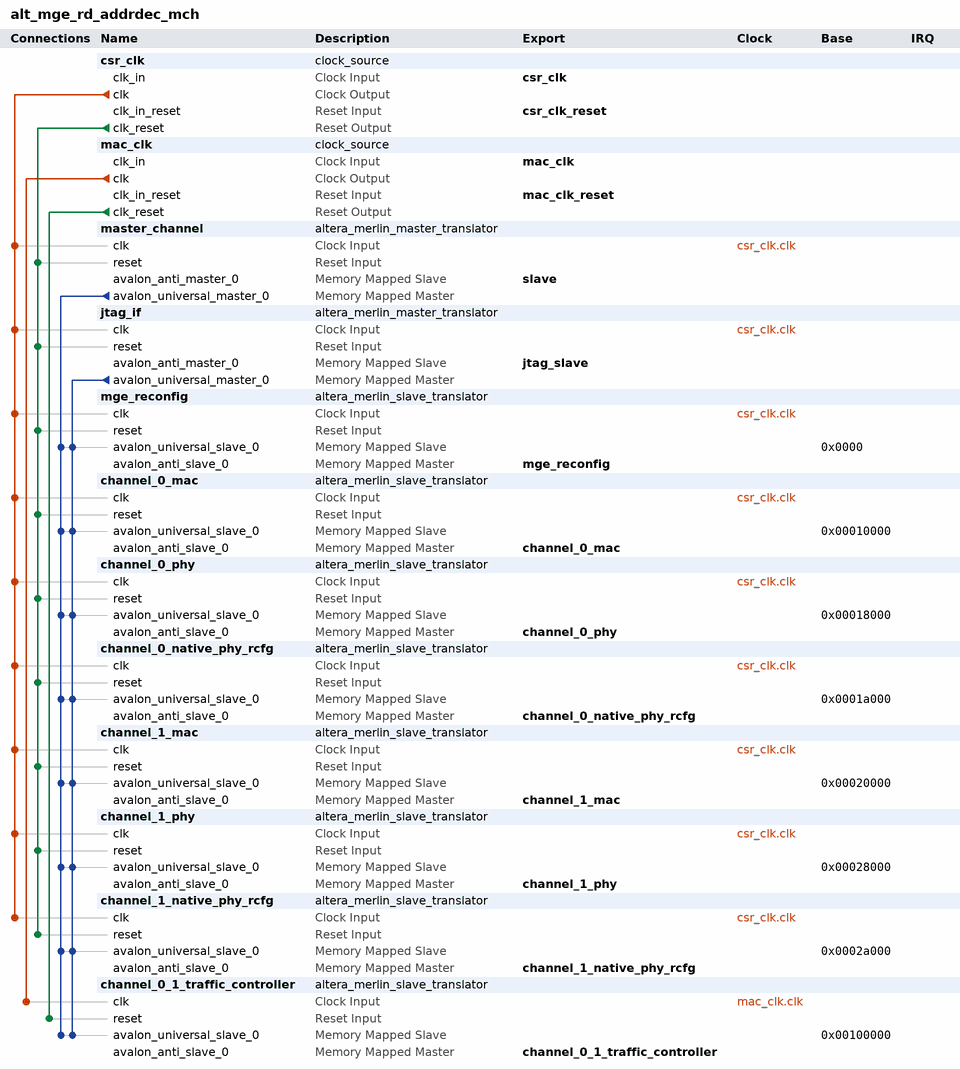
[diagram p0: system contents]
# Platform Designer (Qsys) system alt_mge_rd_addrdec_mch, Arria 10 10AX115S4F45I3SG
# Parameters at their usual value, and those the tool derives, are not listed.
package require -exact qsys 1.0
create_system alt_mge_rd_addrdec_mch
set_project_property DEVICE_FAMILY {Arria 10}
set_project_property DEVICE 10AX115S4F45I3SG

add_component csr_clk ip/alt_mge_rd_addrdec_mch/alt_mge_rd_addrdec_mch_csr_clk.ip clock_source csr_clk 0

add_component mac_clk ip/alt_mge_rd_addrdec_mch/alt_mge_rd_addrdec_mch_mac_clk.ip clock_source mac_clk 

add_component master_channel ip/alt_mge_rd_addrdec_mch/alt_mge_rd_addrdec_mch_master_channel.ip altera_merlin_master_translator master_channel 18.0

add_component jtag_if ip/alt_mge_rd_addrdec_mch/alt_mge_rd_addrdec_mch_jtag_if.ip altera_merlin_master_translator jtag_if 18.0

add_component mge_reconfig ip/alt_mge_rd_addrdec_mch/alt_mge_rd_addrdec_mch_mge_reconfig.ip altera_merlin_slave_translator mge_reconfig 18.0

add_component channel_0_mac ip/alt_mge_rd_addrdec_mch/alt_mge_rd_addrdec_mch_channel_0_mac.ip altera_merlin_slave_translator channel_0_mac 18.0

add_component channel_0_phy ip/alt_mge_rd_addrdec_mch/alt_mge_rd_addrdec_mch_channel_0_phy.ip altera_merlin_slave_translator channel_0_phy 18.0

add_component channel_0_native_phy_rcfg ip/alt_mge_rd_addrdec_mch/alt_mge_rd_addrdec_mch_channel_0_native_phy_rcfg.ip altera_merlin_slave_translator channel_0_native_phy_rcfg 18.0

add_component channel_1_mac ip/alt_mge_rd_addrdec_mch/alt_mge_rd_addrdec_mch_channel_1_mac.ip altera_merlin_slave_translator channel_1_mac 18.0

add_component channel_1_phy ip/alt_mge_rd_addrdec_mch/alt_mge_rd_addrdec_mch_channel_1_phy.ip altera_merlin_slave_translator channel_1_phy 18.0

add_component channel_1_native_phy_rcfg ip/alt_mge_rd_addrdec_mch/alt_mge_rd_addrdec_mch_channel_1_native_phy_rcfg.ip altera_merlin_slave_translator channel_1_native_phy_rcfg 18.0

add_component channel_0_1_traffic_controller ip/alt_mge_rd_addrdec_mch/alt_mge_rd_addrdec_mch_channel_0_1_traffic_controller.ip altera_merlin_slave_translator channel_0_1_traffic_controller 18.0

# connections
add_connection csr_clk.clk channel_0_mac.clk clock
add_connection csr_clk.clk channel_0_native_phy_rcfg.clk clock
add_connection csr_clk.clk channel_0_phy.clk clock
add_connection csr_clk.clk channel_1_mac.clk clock
add_connection csr_clk.clk channel_1_native_phy_rcfg.clk clock
add_connection csr_clk.clk channel_1_phy.clk clock
add_connection csr_clk.clk jtag_if.clk clock
add_connection csr_clk.clk master_channel.clk clock
add_connection csr_clk.clk mge_reconfig.clk clock
add_connection mac_clk.clk channel_0_1_traffic_controller.clk clock
add_connection csr_clk.clk_reset channel_0_mac.reset reset
add_connection csr_clk.clk_reset channel_0_native_phy_rcfg.reset reset
add_connection csr_clk.clk_reset channel_0_phy.reset reset
add_connection csr_clk.clk_reset channel_1_mac.reset reset
add_connection csr_clk.clk_reset channel_1_native_phy_rcfg.reset reset
add_connection csr_clk.clk_reset channel_1_phy.reset reset
add_connection csr_clk.clk_reset jtag_if.reset reset
add_connection csr_clk.clk_reset master_channel.reset reset
add_connection csr_clk.clk_reset mge_reconfig.reset reset
add_connection mac_clk.clk_reset channel_0_1_traffic_controller.reset reset
add_connection jtag_if.avalon_universal_master_0 channel_0_1_traffic_controller.avalon_universal_slave_0 avalon
set_connection_parameter_value jtag_if.avalon_universal_master_0/channel_0_1_traffic_controller.avalon_universal_slave_0 baseAddress 0x00100000
add_connection jtag_if.avalon_universal_master_0 channel_0_mac.avalon_universal_slave_0 avalon
set_connection_parameter_value jtag_if.avalon_universal_master_0/channel_0_mac.avalon_universal_slave_0 baseAddress 0x00010000
add_connection jtag_if.avalon_universal_master_0 channel_0_native_phy_rcfg.avalon_universal_slave_0 avalon
set_connection_parameter_value jtag_if.avalon_universal_master_0/channel_0_native_phy_rcfg.avalon_universal_slave_0 baseAddress 0x0001a000
add_connection jtag_if.avalon_universal_master_0 channel_0_phy.avalon_universal_slave_0 avalon
set_connection_parameter_value jtag_if.avalon_universal_master_0/channel_0_phy.avalon_universal_slave_0 baseAddress 0x00018000
add_connection jtag_if.avalon_universal_master_0 channel_1_mac.avalon_universal_slave_0 avalon
set_connection_parameter_value jtag_if.avalon_universal_master_0/channel_1_mac.avalon_universal_slave_0 baseAddress 0x00020000
add_connection jtag_if.avalon_universal_master_0 channel_1_native_phy_rcfg.avalon_universal_slave_0 avalon
set_connection_parameter_value jtag_if.avalon_universal_master_0/channel_1_native_phy_rcfg.avalon_universal_slave_0 baseAddress 0x0002a000
add_connection jtag_if.avalon_universal_master_0 channel_1_phy.avalon_universal_slave_0 avalon
set_connection_parameter_value jtag_if.avalon_universal_master_0/channel_1_phy.avalon_universal_slave_0 baseAddress 0x00028000
add_connection jtag_if.avalon_universal_master_0 mge_reconfig.avalon_universal_slave_0 avalon
set_connection_parameter_value jtag_if.avalon_universal_master_0/mge_reconfig.avalon_universal_slave_0 baseAddress 0x0000
add_connection master_channel.avalon_universal_master_0 channel_0_1_traffic_controller.avalon_universal_slave_0 avalon
set_connection_parameter_value master_channel.avalon_universal_master_0/channel_0_1_traffic_controller.avalon_universal_slave_0 baseAddress 0x00100000
add_connection master_channel.avalon_universal_master_0 channel_0_mac.avalon_universal_slave_0 avalon
set_connection_parameter_value master_channel.avalon_universal_master_0/channel_0_mac.avalon_universal_slave_0 baseAddress 0x00010000
add_connection master_channel.avalon_universal_master_0 channel_0_native_phy_rcfg.avalon_universal_slave_0 avalon
set_connection_parameter_value master_channel.avalon_universal_master_0/channel_0_native_phy_rcfg.avalon_universal_slave_0 baseAddress 0x0001a000
add_connection master_channel.avalon_universal_master_0 channel_0_phy.avalon_universal_slave_0 avalon
set_connection_parameter_value master_channel.avalon_universal_master_0/channel_0_phy.avalon_universal_slave_0 baseAddress 0x00018000
add_connection master_channel.avalon_universal_master_0 channel_1_mac.avalon_universal_slave_0 avalon
set_connection_parameter_value master_channel.avalon_universal_master_0/channel_1_mac.avalon_universal_slave_0 baseAddress 0x00020000
add_connection master_channel.avalon_universal_master_0 channel_1_native_phy_rcfg.avalon_universal_slave_0 avalon
set_connection_parameter_value master_channel.avalon_universal_master_0/channel_1_native_phy_rcfg.avalon_universal_slave_0 baseAddress 0x0002a000
add_connection master_channel.avalon_universal_master_0 channel_1_phy.avalon_universal_slave_0 avalon
set_connection_parameter_value master_channel.avalon_universal_master_0/channel_1_phy.avalon_universal_slave_0 baseAddress 0x00028000
add_connection master_channel.avalon_universal_master_0 mge_reconfig.avalon_universal_slave_0 avalon
set_connection_parameter_value master_channel.avalon_universal_master_0/mge_reconfig.avalon_universal_slave_0 baseAddress 0x0000

# exported interfaces
add_interface channel_0_1_traffic_controller avalon master
set_interface_property channel_0_1_traffic_controller EXPORT_OF channel_0_1_traffic_controller.avalon_anti_slave_0
add_interface channel_0_mac avalon master
set_interface_property channel_0_mac EXPORT_OF channel_0_mac.avalon_anti_slave_0
add_interface channel_0_native_phy_rcfg avalon master
set_interface_property channel_0_native_phy_rcfg EXPORT_OF channel_0_native_phy_rcfg.avalon_anti_slave_0
add_interface channel_0_phy avalon master
set_interface_property channel_0_phy EXPORT_OF channel_0_phy.avalon_anti_slave_0
add_interface channel_1_mac avalon master
set_interface_property channel_1_mac EXPORT_OF channel_1_mac.avalon_anti_slave_0
add_interface channel_1_native_phy_rcfg avalon master
set_interface_property channel_1_native_phy_rcfg EXPORT_OF channel_1_native_phy_rcfg.avalon_anti_slave_0
add_interface channel_1_phy avalon master
set_interface_property channel_1_phy EXPORT_OF channel_1_phy.avalon_anti_slave_0
add_interface csr_clk clock sink
set_interface_property csr_clk EXPORT_OF csr_clk.clk_in
add_interface csr_clk_reset reset sink
set_interface_property csr_clk_reset EXPORT_OF csr_clk.clk_in_reset
add_interface jtag_slave avalon slave
set_interface_property jtag_slave EXPORT_OF jtag_if.avalon_anti_master_0
add_interface mac_clk clock sink
set_interface_property mac_clk EXPORT_OF mac_clk.clk_in
add_interface mac_clk_reset reset sink
set_interface_property mac_clk_reset EXPORT_OF mac_clk.clk_in_reset
add_interface mge_reconfig avalon master
set_interface_property mge_reconfig EXPORT_OF mge_reconfig.avalon_anti_slave_0
add_interface slave avalon slave
set_interface_property slave EXPORT_OF master_channel.avalon_anti_master_0

set_interconnect_requirement {$system} qsys_mm.clockCrossingAdapter HANDSHAKE
set_interconnect_requirement {$system} qsys_mm.maxAdditionalLatency 1

save_system alt_mge_rd_addrdec_mch.qsys
